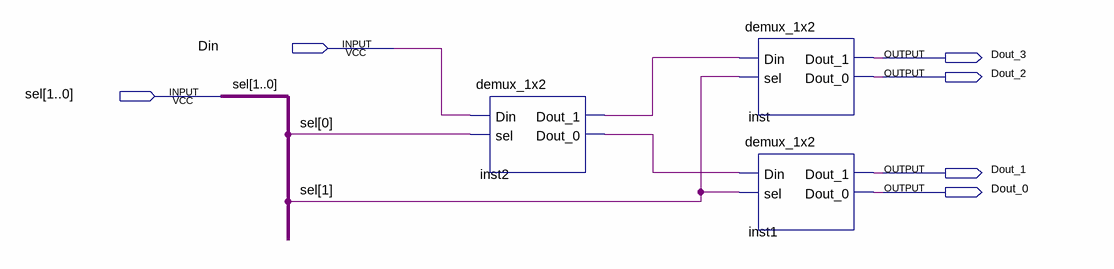
[diagram p0: schematic sheet]
// Quartus schematic demux_1x4.bdf as structural Verilog: 3 symbols, 6 pins
module demux_1x4 (
  input  Din,
  input  [1:0] sel,
  output Dout_3,
  output Dout_2,
  output Dout_1,
  output Dout_0
);

  wire inst2_dout_0, inst2_dout_1;

  demux_1x2 inst2 (.Din(Din), .sel(sel[0]), .Dout_1(inst2_dout_1), .Dout_0(inst2_dout_0));
  demux_1x2 inst (.Din(inst2_dout_1), .sel(sel[1]), .Dout_1(Dout_3), .Dout_0(Dout_2));
  demux_1x2 inst1 (.Din(inst2_dout_0), .sel(sel[1]), .Dout_1(Dout_1), .Dout_0(Dout_0));
endmodule
